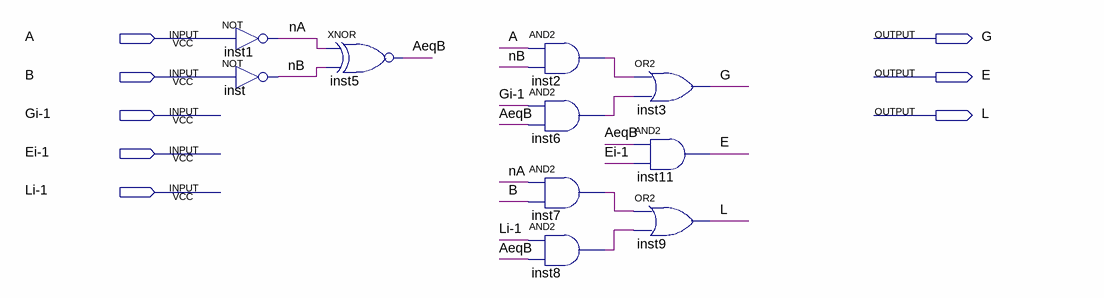
[diagram p0: schematic sheet]
// Quartus schematic CMP1.bdf as structural Verilog: 10 symbols, 8 pins
module CMP1 (
  input  A,
  input  B,
  input  \Gi-1 ,
  input  \Ei-1 ,
  input  \Li-1 ,
  output G,
  output E,
  output L
);

  wire AeqB, inst2_out, inst6_out, inst7_out, inst8_out, nA, nB;

  not inst1 (nA, A);
  not inst (nB, B);
  xnor inst5 (AeqB, nA, nB);
  and inst2 (inst2_out, A, nB);
  and inst6 (inst6_out, \Gi-1 , AeqB);
  and inst7 (inst7_out, nA, B);
  and inst8 (inst8_out, \Li-1 , AeqB);
  or inst3 (G, inst2_out, inst6_out);
  and inst11 (E, AeqB, \Ei-1 );
  or inst9 (L, inst7_out, inst8_out);
endmodule
